# EAGLE board KickerBoard (EAGLE 7.4.0)
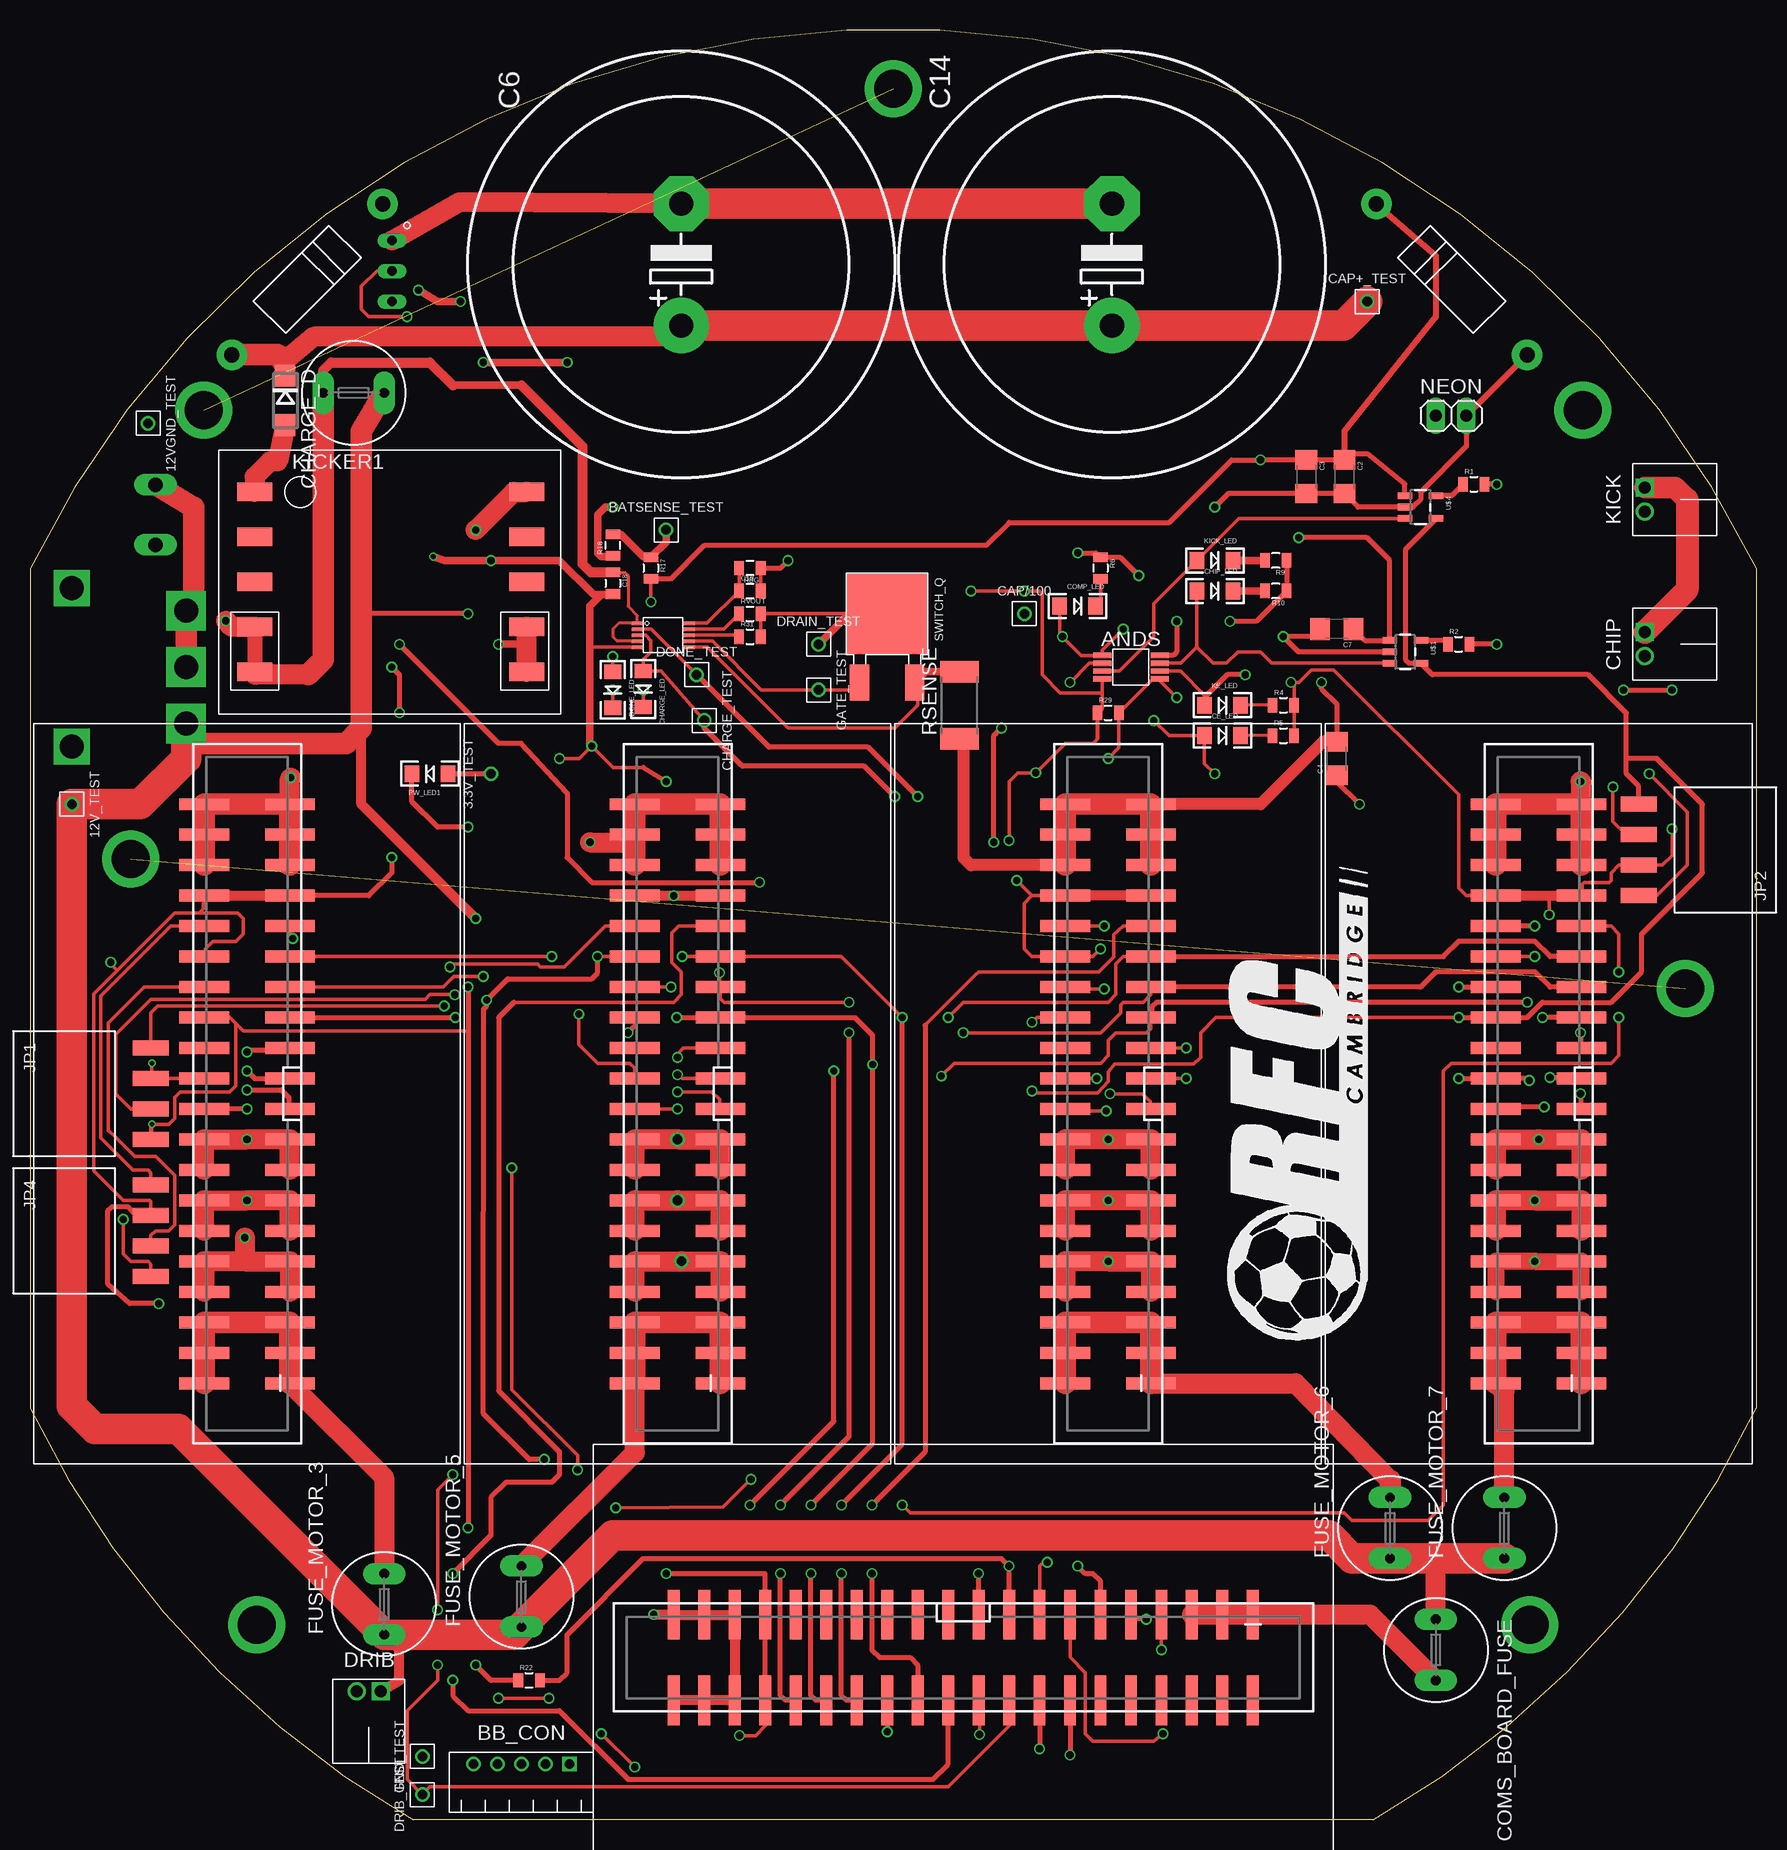
[diagram p3: board, top side]
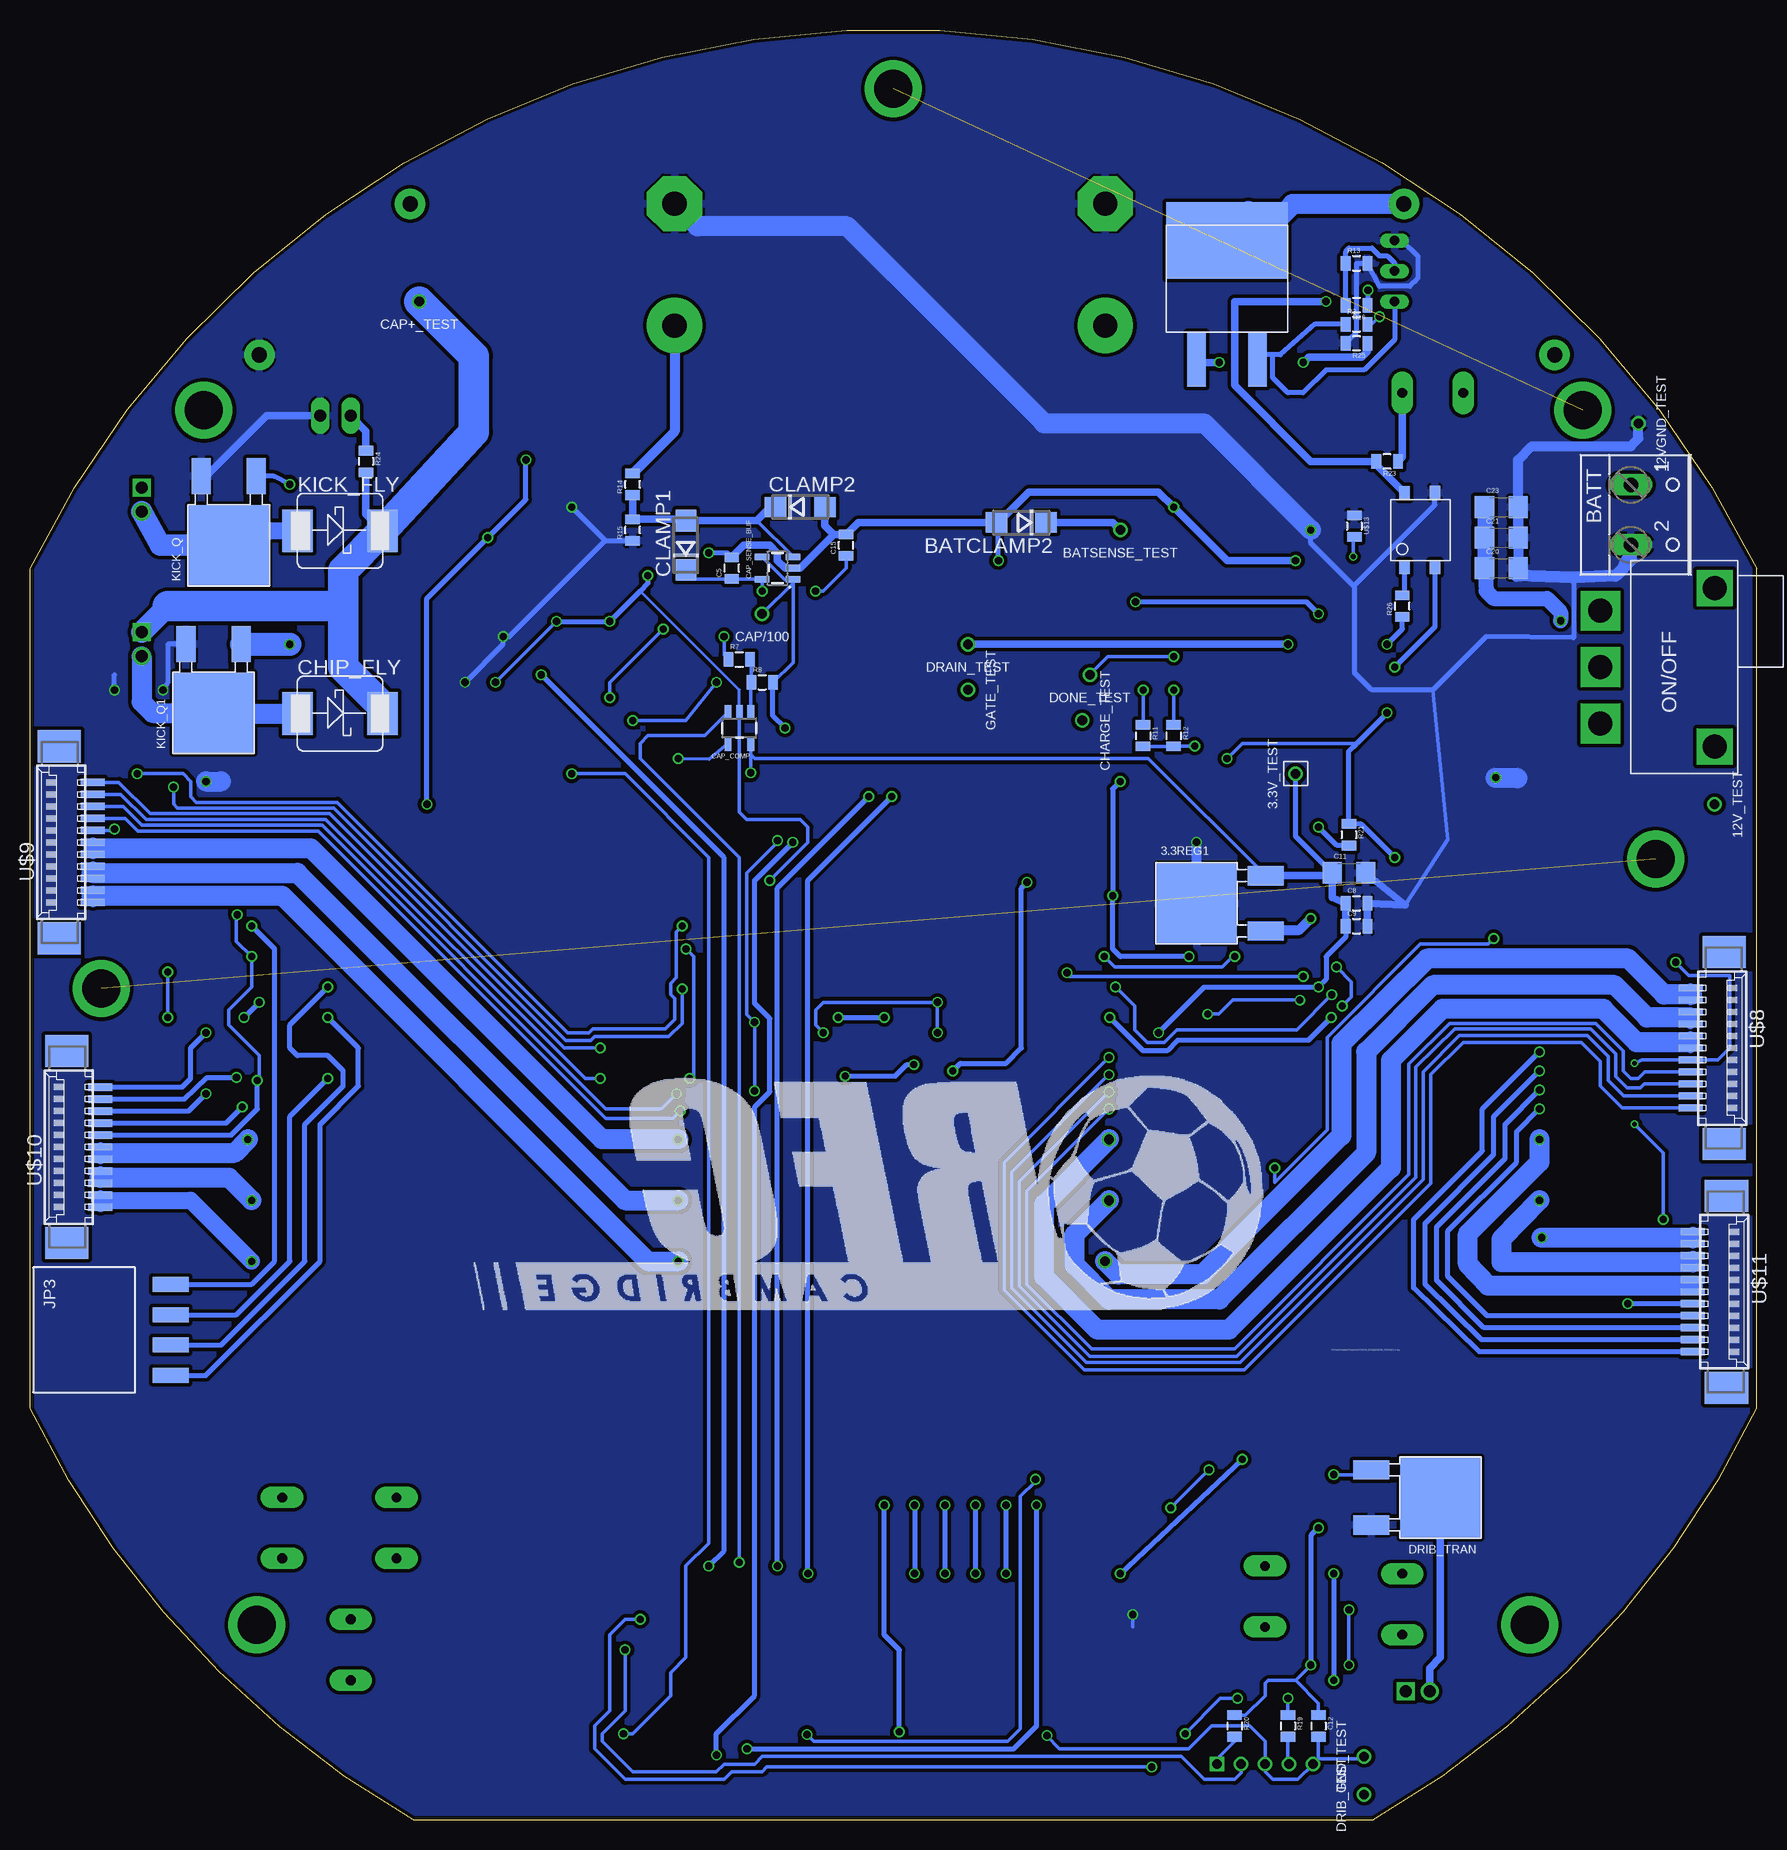
[diagram p4: board, bottom side, seen from below]

Size 143.88 x 149.19 mm. Coordinates in mm from the lower left corner, seen from the top.
Outline: 143.87,34.28 143.87,104.28 arc128 0,104.28 0,34.28 arc34 31.94,0 111.94,0 arc34 143.87,34.28
Copper layers (1*16): Top 0.018mm / dielectric 1.55mm / Bottom 0.018mm
Design rules "eC_2Layer_PClass6_BaseCopperO18_eCDefault": minimum track width 0.15mm, minimum drill 0.35mm, track to track 0.15mm, track to pad 0.15mm, pad to pad 0.15mm, via to via 0.15mm, smd to smd 0mil, copper to edge 0.25mm, drill to drill 0.35mm, minimum pad ring 0.175mm, minimum via ring 0.125mm, stop-mask expansion 0mil, vias tented up to drill 0.45mm, thermal gap 0.2mm

## Footprints (pad centres in the part's own frame; a part is rotated, then mirrored left to right if it is on the bottom)
DPAK = smd 6.7 x 6.7: DRAIN 0,0 | smd 3 x 1.6: GATE 5.75,-2.3; SOURCE 5.75,2.3
TESTING_PT = drill 0.8: P$1 0,0
TSSOP8 = smd 1.5 x 0.45: P$1 -2.4,0.975; P$2 -2.4,0.325; P$3 -2.4,-0.325; P$4 -2.4,-0.975; P$5 2.4,-0.975; P$6 2.4,-0.325; P$7 2.4,0.325; P$8 2.4,0.975
DO214AC = smd 1.8 x 1.7: A 2.05,0; C -2.05,0
W237-102 = drill 1.194 long: 1 -2.5,-1.27; 2 2.5,-1.27
JST-5-2MM = drill 0.8 square: 1 4,0 | drill 0.8: 2 2,0; 3 0,0; 4 -2,0; 5 -4,0
1206 = smd 1.6 x 1.8: 1 -1.4,0; 2 1.4,0
0805 = smd 0.8 x 1.2: 1 -0.9,0; 2 0.9,0
EB35D = drill 2.007 pad 4.597: + -5.08,0 | drill 2.007 pad 4.597 octagon: - 5.08,0
SOT23-5 = smd 0.55 x 1.2: 1 -0.95,-1.3; 2 0,-1.3; 3 0.95,-1.3; 4 0.95,1.3; 5 -0.95,1.3
LED-1206 = smd 1.2 x 1.4: A -1.5,0; C 1.5,0
10-MSOP = smd 0.97 x 0.31: P$1 -0.485,-0.155; P$2 -0.485,-0.655; P$3 -0.485,-1.155; P$4 -0.485,-1.655; P$5 -0.485,-2.155; P$6 3.785,-2.155; P$7 3.785,-1.655; P$8 3.785,-1.155; P$9 3.785,-0.655; P$10 3.785,-0.155
JST-2-2MM = drill 1 square: 1 1,1 | drill 1: 2 -1,1
DO214AB = smd 2.54 x 3.556: ANODE 0,3.111; CATHODE 7.112,3.111
2X20_SHROUDED_SMT = smd 4.14 x 0.991: 1 -3.569,24.13; 2 3.569,24.13; 3 -3.569,21.59; 4 3.569,21.59; 5 -3.569,19.05; 6 3.569,19.05; 7 -3.569,16.51; 8 3.569,16.51; 9 -3.569,13.97; 10 3.569,13.97; 11 -3.569,11.43; 12 3.569,11.43; 13 -3.569,8.89; 14 3.569,8.89; 15 -3.569,6.35; 16 3.569,6.35; 17 -3.569,3.81; 18 3.569,3.81; 19 -3.569,1.27; 20 3.569,1.27; 21 -3.569,-1.27; 22 3.569,-1.27; 23 -3.569,-3.81; 24 3.569,-3.81; 25 -3.569,-6.35; 26 3.569,-6.35; 27 -3.569,-8.89; 28 3.569,-8.89; 29 -3.569,-11.43; 30 3.569,-11.43; 31 -3.569,-13.97; 32 3.569,-13.97; 33 -3.569,-16.51; 34 3.569,-16.51; 35 -3.569,-19.05; 36 3.569,-19.05; 37 -3.569,-21.59; 38 3.569,-21.59; 39 -3.569,-24.13; 40 3.569,-24.13
TR5 = drill 0.813 pad 1.778 long: 1 -2.54,0; 2 2.54,0
1X04_SMD_RA_FEMALE = smd 1.25 x 3: 1 -3.81,7.225; 2 -1.27,7.225; 3 1.27,7.225; 4 3.81,7.225
1X02 = drill 1.016 long: 1 -1.27,0; 2 1.27,0
CK_SWITCH = drill 2 pad 3.302 square: COM 0,0; IN1 4.699,0; IN2 -4.699,0 | drill 2 pad 2.54 square: SUP1 -6.604,-9.525; SUP2 6.604,-9.525
R2512 = smd 1.8 x 3.2: 1 -2.8,0; 2 2.8,0
TO-263 = smd 1.524 x 4.572: LOWER_LEFT 2.54,-2.286; LOWER_RIGHT 7.62,-2.286 | smd 10.16 x 6.35: TAB 5.08,7.62
10-TRANSFORMER = smd 2.92 x 1.52: P$1 0,0; P$2 0,-3.75; P$3 0,-7.5; P$4 0,-11.25; P$5 0,-15; P$6 22.67,-15; P$7 22.67,-11.25; P$8 22.67,-7.5; P$9 22.67,-3.75; P$10 22.67,0
SOP4 = smd 0.889 x 1.143: 1 0.813,-0.584; 2 3.353,-0.584; 3 3.353,5.664; 4 0.813,5.639
TO92 = drill 0.8 long: CENTER 2.54,0; LEFT 0,0; RIGHT 5.08,0
THROUGH-HOLE-2 = drill 1.27 pad 2.54: + 0,0; - 17.78,0
GEN3CON = smd 0.61 x 2: 1 5,-2; 2 4,-2; 3 3,-2; 4 2,-2; 5 1,-2; 7 -1,-2; 8 -2,-2; 9 -3,-2; 10 -4,-2; 11 -5,-2 | smd 0.6 x 2: 6 0,-2 | smd 2.68 x 3.6: S1 8,0.8; S2 -8,0.8

## Placement (x,y rotation side)
3.3REG1  3.3REG1AREG  [DPAK]  46.66,76.39 0 bottom
3.3V_TEST  TEST_PT  [TESTING_PT]  38.41,87.19 90 bottom
12V_TEST  TEST_PT  [TESTING_PT]  3.48,84.65 270 top
12VGND_TEST  TEST_PT  [TESTING_PT]  9.83,116.4 270 top
ANDS  AND-DUAL  [TSSOP8]  91.75,96.08 180 top
BATCLAMP2  DIODE-ZENERDO214AC  [DO214AC]  61.27,108.14 180 bottom
BATSENSE_TEST  TEST_PT  [TESTING_PT]  53.01,107.51 0 top
BATT  [W237-102]  9.2,108.78 270 bottom
BB_CON  JST-5  [JST-5-2MM]  40.95,4.64 0 top
C2  .1uF  [1206]  109.53,111.95 270 top
C3  10uF  [1206]  106.35,111.95 270 top
C4  .1uF  [1206]  108.89,88.46 90 top
C5  .1uF  [0805]  85.4,104.33 90 bottom
C6  1500uF  [EB35D]  54.26,129.64 90 top
C7  10uF  [1206]  108.89,99.25 180 top
C8  1uF  [0805]  33.33,76.39 0 bottom
C9  .01uF  [0805]  33.33,74.49 0 bottom
C11  47uF  [1206]  33.96,78.93 0 bottom
C12  4.7uF  [0805]  36.5,7.81 270 bottom
C14  1500uF  [EB35D]  90.16,129.64 90 top
C15  .1uF  [0805]  75.87,106.24 90 bottom
C18  10uF  [0805]  48.57,103.06 270 top
C19  100pF  [0805]  60,102.43 0 top
C20  47uF  [1206]  21.26,104.33 0 bottom
C21  47uF  [1206]  21.26,106.87 0 bottom
C23  47uF  [1206]  21.26,109.41 0 bottom
CAP+_TEST  TEST_PT  [TESTING_PT]  111.43,126.56 0 top
CAP/100  TEST_PT  [TESTING_PT]  82.86,100.52 0 top
CAP_COMP  LM331  [SOT23-5]  84.76,91 180 bottom
CAP_SENSE_BUF  MCP6291T-E/OT  [SOT23-5]  81.59,104.33 90 bottom
CE_LED  [LED-1206]  99.37,90.36 0 top
CHARGE_D  1kV, ultrafast  [DO214AC]  21.26,118.3 270 top
CHARGE_LED  [LED-1206]  51.11,94.25 270 top
CHARGE_TEST  TEST_PT  [TESTING_PT]  56.19,91.63 270 top
CHARGE_U  LT3750  [10-MSOP]  51.11,99.89 0 top
CHIP  JST-22MM  [JST-2-2MM]  135.56,97.98 90 top
CHIP_FLY  DIODE-ZENERDO214AB  [DO214AB]  121.59,89.09 0 bottom
CHIP_LED  [LED-1206]  98.73,102.43 0 top
CLAMP1  DIODE-ZENERDO214AC  [DO214AC]  89.21,106.24 90 bottom
CLAMP2  DIODE-ZENERDO214AC  [DO214AC]  79.68,109.41 0 bottom
COM_BOARD  M20X2SHROUDED_SMT  [2X20_SHROUDED_SMT]  77.78,13.53 270 top
COMP_LED  [LED-1206]  87.3,101.16 0 top
COMS_BOARD_FUSE  [TR5]  117.15,14.16 270 top
DONE_LED  [LED-1206]  48.57,94.17 270 top
DONE_TEST  TEST_PT  [TESTING_PT]  55.55,95.44 0 top
DRAIN_TEST  TEST_PT  [TESTING_PT]  65.71,97.98 0 top
DRIB  JST-22MM  [JST-2-2MM]  28.25,9.72 0 top
DRIB_TEST  TEST_PT  [TESTING_PT]  32.69,2.1 90 top
DRIB_TRAN  [DPAK]  26.34,26.86 180 bottom
FRAME4  FRAME-LETTER  [CREATIVE_COMMONS]  36.5,-39.18 0 top  (outside the outline)
FUSE_MOTOR_3  [TR5]  29.52,17.97 90 top
FUSE_MOTOR_5  [TR5]  40.95,18.61 90 top
FUSE_MOTOR_6  [TR5]  113.34,24.32 90 top
FUSE_MOTOR_7  [TR5]  122.86,24.32 90 top
GATE_TEST  TEST_PT  [TESTING_PT]  65.71,94.17 270 top
GND_TEST  TEST_PT  [TESTING_PT]  32.69,5.27 90 top
JP1  [1X04_SMD_RA_FEMALE]  2.85,60.52 270 top
JP2  [1X04_SMD_RA_FEMALE]  141.28,80.84 90 top
JP3  [1X04_SMD_RA_FEMALE]  139.37,40.83 270 bottom
JP4  [1X04_SMD_RA_FEMALE]  2.85,49.09 270 top
KE_LED  [LED-1206]  99.37,92.9 0 top
KICK  JST-22MM  [JST-2-2MM]  135.56,110.05 90 top
KICK_FLY  DIODE-ZENERDO214AB  [DO214AB]  121.59,104.33 0 bottom
KICK_LED  [LED-1206]  98.73,104.97 0 top
KICK_Q  [DPAK]  127.31,106.24 90 bottom
KICK_Q1  [DPAK]  128.58,92.27 90 bottom
KICKER1  [TR5]  26.98,118.94 180 top
MOTOR1  M20X2SHROUDED_SMT  [2X20_SHROUDED_SMT]  18.09,60.52 180 top
MOTOR2  M20X2SHROUDED_SMT  [2X20_SHROUDED_SMT]  53.97,60.52 180 top
MOTOR3  M20X2SHROUDED_SMT  [2X20_SHROUDED_SMT]  89.84,60.52 180 top
MOTOR4  M20X2SHROUDED_SMT  [2X20_SHROUDED_SMT]  125.72,60.52 180 top
NEON  [1X02]  118.42,117.03 0 top
ON/OFF  SPDT-SWITCH  [CK_SWITCH]  13.01,96.08 90 bottom
PW_LED1  [LED-1206]  33.33,87.19 180 top
R1  100  [0805]  120.32,111.32 0 top
R2  100  [0805]  119.05,97.98 0 top
R3  250k  [0805]  33.33,124.65 0 bottom
R4  1k  [0805]  104.45,92.9 0 top
R5  1k  [0805]  104.45,90.36 0 top
R6  1k  [0805]  89.21,104.33 270 top
R7  100k  [0805]  84.76,96.71 0 bottom
R8  3k  [0805]  82.86,94.81 0 bottom
R9  1k  [0805]  103.81,104.97 180 top
R10  1k  [0805]  103.81,102.43 180 top
R11  1k  [0805]  51.11,90.36 270 bottom
R12  1k  [0805]  48.57,90.36 270 bottom
R13  2.5k  [0805]  33.33,129.73 0 bottom
R14  1M  [0805]  93.65,111.32 90 bottom
R15  10K  [0805]  93.65,107.51 90 bottom
R16  1k  [0805]  33.33,126.24 180 bottom
R17  80k  [0805]  51.74,104.33 270 top
R18  20k  [0805]  48.57,106.24 90 top
R19  20  [0805]  39.04,7.81 270 bottom
R20  100  [0805]  43.49,7.81 270 bottom
R21  1k  [0805]  33.96,82.11 270 bottom
R22  1k  [0805]  41.58,11.62 0 top
R23  1.5k  [0805]  30.79,113.22 180 bottom
R24  536k  [0805]  115.88,113.22 270 bottom
R25  200  [0805]  33.33,123.07 180 bottom
R26  300  [0805]  29.52,101.16 90 bottom
R29  10k  [0805]  89.84,92.27 0 top
R31  43k  [0805]  60,98.62 0 top
RBG  2.49k  [0805]  60,104.33 180 top
RSENSE  10m  [R2512]  77.46,92.9 90 top
RVOUT  50.4k  [0805]  60,100.52 0 top
SWITCH_Q  [DPAK]  71.43,100.52 270 top
U$1  FAN31111  [SOT23-5]  114.61,97.35 270 top
U$2  IXTA3N50D2  [TO-263]  49.2,124.02 0 bottom
U$3  32052-TRANSFORMER  [10-TRANSFORMER]  18.72,110.68 0 top
U$4  FAN31111  [SOT23-5]  115.88,109.41 270 top
U$5  VO1400AEFTR  [SOP4]  30.15,104.97 0 bottom
U$6  ZTX718  [TO92]  30.15,131.64 270 top
U$7  1N4007  [THROUGH-HOLE-2]  16.82,122.11 45 top
U$8  MOTORCON  [GEN3CON]  3.48,64.33 270 bottom
U$9  MOTORCON  [GEN3CON]  140.64,81.47 90 bottom
U$10  MOTORCON  [GEN3CON]  140.01,56.07 90 bottom
U$11  MOTORCON  [GEN3CON]  3.29,44.01 270 bottom
U$12  13VZENER  [THROUGH-HOLE-2]  124.77,122.11 135 top
U$13  INDUCTOR  [0805]  33.51,107.84 270 bottom

## Tracks (layer width: path | path; a pad name or v marks a point on that pad's centre or on a via)
3.3V  (via drill 0.38, 0.6)
  Top 0.305: 89.35,93.94 89.35,92.67 R29.1 88.94,90.1 | 89.35,93.94 ANDS.P$8 89.35,92.57 88.97,92.19 88.97,90.13 88.94,90.1 | JP4.4 10.07,46.31 9.83,46.55 8.4,46.55 7.77,47.18 v7.77,50.04 | v10.15,57.98 10.15,56.79 JP1.4 10.07,57.9 v10.15,57.98 | v10.15,57.98 11.58,57.98 12.06,58.46 12.06,60.2 12.53,60.68 16.66,60.68 17.14,61.15 17.14,66.39 | 17.14,66.39 16.66,66.87 MOTOR1.26 | 17.14,66.39 17.77,65.76 36.34,65.76 36.5,65.6 | 88.94,90.1 88.57,89.73 86.27,89.73 v83.81,87.27 82.3,87.27 81.59,86.55 v81.59,81.63 | v78.41,102.43 v82.86,102.43 84.13,102.43 84.37,102.19 84.37,95.44 85.87,93.94 89.35,93.94 | v83.49,66.47 83.89,66.87 MOTOR3.26 | 114.61,96.71 114.93,96.4 115.96,96.4 115.96,96.32 116.83,95.44 129.85,95.44 | 124.77,66.87 98.81,66.87 97.54,65.6 97.54,63.54 96.99,62.98 90.4,62.98 89.84,62.35 89.84,61.55 88.97,60.6 83.65,60.6 v83.49,60.76
  Top 0.406: U$4.4 114.61,105.89 114.61,96.71 114.92,96.4 U$1.4 116.86,95.44 129.85,95.44 133.02,92.27 133.02,88.46 | v36.5,69.41 36.5,65.6 v36.5,24.32 | R22.1 38.41,11.62 v37.14,12.89 | PW_LED1.A 3.3V_TEST.P$1 | v49.84,65.6 50.47,66.23 50.47,66.79 MOTOR2.26 | v119.05,66.87 MOTOR4.26 124.77,66.87 126.04,68.14 131.75,68.14 134.29,70.68 134.29,73.85 139.37,78.93 139.37,84.65 135.56,88.46 133.02,88.46 | JP2.4 134.05,86.16 133.02,87.19 133.02,88.46
  Bottom 0.305: 3.3REG1.SOURCE 50.68,88.46 83.49,88.46 83.81,88.78 CAP_COMP.5 v83.81,87.27 | C5.1 82.94,103.43 CAP_SENSE_BUF.5 82.86,103.35 v82.86,102.43 82.86,103.38 82.91,103.43 C5.1 | C5.1 88.45,103.43 arc90 CLAMP1.C | v7.77,50.04 7.77,55.6 v10.15,57.98 | R20.1 42.59,8.71 40.95,10.35 40.95,11.36 R22.1 38.41,11.62 | 38.41,11.62 v37.14,12.89 | C15.1 75.87,104.33 77.78,102.43 v78.41,102.43 | v81.59,81.63 81.59,81.47 84.13,78.93 84.13,67.11 v83.49,66.47 v83.49,60.76 | C12.1 36.5,9.72 38.41,11.62
  Bottom 0.406: C9.1 34.23,73.59 35.87,71.95 35.87,70.04 v36.5,69.41 46.03,69.41 v49.84,65.6 | v37.14,12.89 37.14,23.69 v36.5,24.32 | C11.1 38.41,81.98 3.3V_TEST.P$1 | JP3.4 129.21,37.02 119.69,46.55 119.69,57.98 116.51,61.15 116.51,64.33 v119.05,66.87
  Bottom 0.61: C9.1 C8.1 35.36,76.89 C11.1 35.6,78.69 3.3REG1.SOURCE
12V  (via drill 0.6)
  Top 0.305: v51.74,101.53 R17.2
  Top 0.406: U$4.1 114.58,111.35 111.43,113.86 109.53,113.86 C2.1 C3.1 v102.54,113.35 100.13,113.35 94.92,108.14 81.59,108.14 79.68,106.24 56.19,106.24 53.38,103.43 R17.2 | v105.72,106.87 111.43,106.87 113.31,105 U$1.1 111.25,98.3 C7.1 | C4.1 108.89,86.55 v110.8,84.65 | v36.5,100.52 27.61,100.52
  Top 0.508: U$12.- 117.15,130.37 117.15,125.29 109.53,115.76 C2.1
  Top 0.61: ON/OFF.IN2 13.26,89.73
  Top 0.813: DRIB.1 30.79,11.62 30.79,14.16 FUSE_MOTOR_3.1 | v37.14,75.12 27.61,84.65 27.61,91
  Top 1.676: COMS_BOARD_FUSE.1 117.15,21.15 117.78,21.78 118.42,21.78
  Top 1.778: 13.26,89.73 26.34,89.73 27.61,91 27.61,100.52 27.61,115.76 KICKER1.1
  Top 2.54: ON/OFF.IN2 13.01,88.46 9.2,84.65 12V_TEST.P$1 3.48,34.48 5.39,32.58 12.37,32.58 FUSE_MOTOR_3.1 40.31,15.43 FUSE_MOTOR_5.1 48.57,23.69 108.26,23.69 110.16,21.78 FUSE_MOTOR_6.1 118.42,21.78 FUSE_MOTOR_7.1
  Bottom 0.406: v102.54,113.35 102.54,110.05 v105.72,106.87 110.8,101.79 v110.8,84.65 | v51.74,101.53 37.51,101.53 v36.5,100.52
  Bottom 0.61: R23.1 29.52,113.59 KICKER1.1
  Bottom 0.813: 3.3REG1.GATE 40.36,74.17 38.09,74.17 v37.14,75.12
12V-KICKER  (via drill 0.6)
  Top 0.254: CHARGE_U.P$4 48.95,98.23 48.57,98.62 48.57,99.25 49.05,99.73 CHARGE_U.P$1 50.62,100.37 49.84,101.16 49.84,103.7 49.57,103.96 C18.1
  Top 0.61: 35.23,119.57 40.95,119.57
  Top 0.813: 24.44,96.71 24.44,120.84 25.07,121.48 33.33,121.48 35.23,119.57 | 40.95,119.57 46.03,114.49 46.03,104.7 46.77,103.96 C18.1
  Top 1.27: U$3.P$4 U$3.P$5
  Top 1.676: 23.17,95.44 18.8,95.44 U$3.P$5 | U$3.P$4 16.82,99.43 v16.31,99.94
  Top 1.778: KICKER1.2 24.44,96.71 23.17,95.44
  Bottom 1.27: C23.1 C21.1 C20.1 22.53,102.43 21.9,101.79 17.45,101.79 16.31,100.65 v16.31,99.94
12VGND  (via drill 0.6)
  Top 0.305: COM_BOARD.39
  Top 0.406: NEON.2 119.69,114.49 115.88,110.68 115.88,110.05 115.24,109.41 U$4.2 110.67,109.41 C2.2 C3.2 99.87,110.55 v98.73,109.41 | U$1.2 105.72,97.35 v104.45,98.62 106.86,98.62 C7.2 | v107.62,94.81 107.62,94.3 108.89,93.03 C4.2 | v132.79,94.17 v136.83,94.17
  Top 0.508: NEON.2 U$12.+
  Top 0.813: COM_BOARD.39 COM_BOARD.37 COM_BOARD.35 COM_BOARD.36 COM_BOARD.38 COM_BOARD.40 | COM_BOARD.39 v51.98,17.1
  Top 1.016: C4.2 107.75,89.86 102.54,84.65 MOTOR3.39 | MOTOR3.40 86.27,80.44 86.03,79.57 78.41,79.57 77.78,80.2 77.78,89.79 RSENSE.1
  Top 1.676: v37.14,107.51 40.31,110.68 U$3.P$10 | C6.- 35.75,134.81 U$6.LEFT | v46.66,81.47 50.4,81.47 | MOTOR1.39 21.66,86.79 v21.74,86.87 | MOTOR4.39 129.29,86.48 v129.21,86.55
  Top 1.778: MOTOR4.36 MOTOR4.38 MOTOR4.40 MOTOR4.39 MOTOR4.37 MOTOR4.35 | MOTOR1.36 MOTOR1.38 MOTOR1.40 MOTOR1.39 MOTOR1.37 MOTOR1.35 | MOTOR2.36 50.4,81.47 MOTOR2.38 MOTOR2.40 MOTOR2.39 MOTOR2.37 MOTOR2.35 | MOTOR3.36 MOTOR3.38 MOTOR3.40 MOTOR3.39 MOTOR3.37 MOTOR3.35
  Top 2.54: C6.- C14.-
  Bottom 0.305: 29.25,76.26 25.71,81.71 26.98,94.17 | v51.98,17.1 51.98,16.07
  Bottom 0.406: 33.52,102.78 37.14,106.4 v37.14,107.51 | v98.73,109.41 95.93,106.61 | 95.93,106.61 R15.1 | 95.93,106.61 103.92,98.62 v104.45,98.62 104.45,97.98 v107.62,94.81 | 33.52,102.78 33.52,95.63 32.06,94.17 26.98,94.17 22.53,98.62 15.23,98.54 15.23,103.54 11.7,103.74 BATT.2 | 33.52,102.78 33.52,102.87 26.8,109.59 U$5.3 | R25.2 33.96,123.38 33.33,124.02 33.33,129.73 R13.2 32.38,129.68 31.42,127.83 28.88,127.83 28.25,128.46 28.25,130.37 29.52,131.64 U$6.LEFT | KICK_Q1.SOURCE 132.35,98.02 132.39,97.98 132.39,94.81 v132.79,94.17 | v136.83,94.17 136.83,95.44
  Bottom 0.61: C9.2 C8.2 29.25,76.26 C11.2 | NEON.2 124.13,117.03 129.18,111.99 KICK_Q.SOURCE
  Bottom 0.813: C23.2 C21.2 | C21.2 C20.2 | C21.2 19.86,113.35 18.72,114.49 10.47,114.49 9.83,115.13 12VGND_TEST.P$1 | 3.3REG1.DRAIN v46.66,81.47
  Bottom 1.016: BATT.2 10.47,105.01 11.74,103.7 15.23,103.54 19.99,103.7 C20.2
  Bottom 1.676: v37.14,107.51 46.03,116.4 59.36,116.4 75.78,132.81 88.26,132.81 C14.- | v21.74,86.87 19.99,86.87 19.91,86.79 | v129.21,86.55 127.94,86.55
  pour Bottom (isolate 0.305): -2.23,149.42 146.99,150.69 145.72,0.19 -0.33,-0.44
AND_CHIP
  Top 0.305: CHIP_LED.A 97.23,97.75 | 97.23,97.75 95.88,96.4 ANDS.P$3 | 97.23,97.75 98.59,96.4 99.69,96.4 100.64,97.35 102.54,97.35 103.49,96.4 U$1.3
AND_KICK
  Top 0.305: ANDS.P$7 90.79,95.75 93.65,98.62 93.65,101.39 KICK_LED.A 100.73,108.46 U$4.3
BAT+
  Top 1.778: BATT.1 13.64,109.37 | 13.64,109.37 13.64,109.41 | 13.64,109.37 13.64,100.14 ON/OFF.IN1 ON/OFF.COM
BATSENSE
  Top 0.305: 51.69,105.29 R17.1
  Top 0.61: R17.1 53.01,106.5 BATSENSE_TEST.P$1 | R18.2 49.26,107.14 51.11,105.29 51.69,105.29
  Bottom 0.61: BATSENSE_TEST.P$1 53.65,108.14 BATCLAMP2.C
BB_IN  (via drill 0.6)
  Top 0.305: v94.29,14.16 COM_BOARD.7
  Bottom 0.305: BB_CON.2 42.95,3.91 43.49,3.37 46.03,3.37 47.93,5.27 82.86,5.27 83.49,4.64 86.03,4.64 86.67,4 93.65,4 96.19,6.54 96.19,7.18 94.29,9.08 v94.29,14.16
BB_OUT  (via drill 0.6)
  Top 0.305: v39.04,10.12 v43.25,10.12 | v47.62,7.18 v50.39,4.4 | v93.02,16.7 92.14,16.7 COM_BOARD.9
  Bottom 0.305: R19.1 v39.04,10.12 | v43.25,10.12 44.68,10.12 v47.62,7.18 | v50.39,4.4 82.46,4.4 82.86,4 85.4,4 86.03,3.37 94.29,3.37 96.83,5.91 96.83,7.81 95.56,9.08 95.56,15.43 94.29,16.7 v93.02,16.7
CAP+
  Top 0.406: 53.73,124.02 C6.+
  Top 1.676: C6.+ 54.19,124.56 | 53.65,124.02 53.73,124.02 53.32,123.61 23.64,123.61 21.26,121.62 | CHARGE_D.C 21.26,121.62 | 21.12,121.48 21.26,121.62
  Top 1.778: KICK.1 137.1,111.05 138.1,110.05 | U$7.+ 20.63,122.11 21.12,121.48
  Top 1.93: 138.1,110.05 138.1,102.52 CHIP.1
  Top 2.54: C6.+ C14.+ 109.43,124.56 CAP+_TEST.P$1
  Bottom 0.61: KICK_FLY.CATHODE 115.88,108.84 R24.2
  Bottom 0.813: C14.+ 90.16,115.71 R14.2
  Bottom 1.676: 114.48,92.78 CHIP_FLY.CATHODE
  Bottom 1.778: CHIP.1 132.39,101.16
  Bottom 2.54: 117.78,101.16 117.78,104.14 KICK_FLY.CATHODE 106.89,115.67 106.89,122.02 CAP+_TEST.P$1 | 117.78,101.16 117.78,96.08 114.48,92.78 | 132.39,101.16 117.78,101.16
CHARGE  (via drill 0.6)
  Top 0.254: CHARGE_LED.A 51.11,95.44
  Top 0.305: CHARGE_LED.A 52.61,95.76 CHARGE_TEST.P$1 | 51.11,95.44 51.11,96.71 51.74,97.35 51.74,98.3 51.31,98.73 CHARGE_U.P$3
  Top 0.406: COM_BOARD.19 v79.05,20.51 | v72.06,85.28 69.52,87.82 59.36,87.82 56.19,91 CHARGE_TEST.P$1
  Bottom 0.406: v79.05,20.51 79.05,78.3 v72.06,85.28
CHARGE_DONE  (via drill 0.6)
  Top 0.305: CHARGE_U.P$2 51.76,99.23 DONE_TEST.P$1 | DONE_LED.A v48.57,96.95
  Top 0.406: COM_BOARD.17 v81.59,21.15 80.95,21.78 51.11,21.78 44.76,15.43 44.76,12.26 44.12,11.62 R22.2 | v73.97,85.28 69.84,89.41 61.59,89.41 DONE_TEST.P$1
  Bottom 0.305: v48.57,96.95 54.05,96.95 DONE_TEST.P$1
  Bottom 0.406: v81.59,21.15 81.59,77.66 v73.97,85.28
CHIP_ENABLE  (via drill 0.6)
  Top 0.305: ANDS.P$6 88.26,96.4 v86.67,94.81 | v93.65,91.63 94.92,90.36 CE_LED.A 97.87,88.05 v98.73,87.19 | COM_BOARD.13 86.67,13.53 87.94,12.26 87.94,7.18 88.57,6.54 93.65,6.54 v94.42,7.18
  Bottom 0.305: v86.67,94.81 89.21,91.63 v93.65,91.63 | v94.42,7.18 93.65,7.18 90.48,10.35 90.48,12.26 89.21,13.53 89.21,21.15 87.3,23.05 87.3,80.2 94.29,87.19 v98.73,87.19
COMP_OUT  (via drill 0.6)
  Top 0.305: v89.84,88.46 90.74,89.36 R29.2 93.58,95.1 ANDS.P$1 94.15,94.95 v95.56,93.54 | COMP_LED.A 85.8,98.85 v86.03,98.62 87.6,97.05 ANDS.P$5 89.35,97.49 v91.11,99.25
  Bottom 0.305: CAP_COMP.4 87.27,88.43 v89.84,88.46 | v86.03,98.62 86.03,97.08 R7.1 | v91.11,99.25 95.56,94.81 v95.56,93.54
DISCHARGE  (via drill 0.6)
  Top 0.406: COM_BOARD.16 v84.13,5.91 | v60,26.23 66.98,33.21 v66.98,62.42 | v30.79,97.98 39.04,89.73 40.95,89.73 44.76,85.6 44.76,80.2 46.82,78.14 v60.79,78.14
  Bottom 0.406: v84.13,5.91 61.9,5.91 60,7.81 v60,26.23 | v66.98,62.42 66.35,63.06 62.54,63.06 61.27,64.33 61.27,77.66 v60.79,78.14 | v30.79,97.98 29.52,99.25 R26.1
DIVCAP  (via drill 0.6)
  Top 0.406: COM_BOARD.14 v86.67,5.4 | v80.32,81.47 80.32,90.36 v80.95,91
  Bottom 0.305: CAP_SENSE_BUF.4 80.99,103.38 CAP_SENSE_BUF.1 | R8.2 80.29,96.48 CAP_SENSE_BUF.1 | CAP/100.P$1 80.29,103.09 CAP_SENSE_BUF.1
  Bottom 0.406: v86.67,5.4 86.67,7.18 83.49,10.35 83.49,59.41 82.22,60.68 82.22,66.79 83.49,68.06 83.49,78.3 v80.32,81.47 | v80.95,91 81.96,92 R8.2
DRIB  (via drill 0.6)
  Top 0.305: COM_BOARD.18 81.59,7.81 76.51,2.73 33.33,2.73 DRIB_TEST.P$1 31.42,3.37 31.42,9.08 33.96,11.62 v33.96,12.89 | v33.96,17.5 33.96,27.5 v35.23,28.77
  Bottom 0.305: v33.96,12.89 v33.96,17.5 | v35.23,28.77 32.49,28.77 DRIB_TRAN.GATE
GND  (via drill 0.38, 0.41, 0.58, 0.6)
  Top 0: C19.2 60.95,102.48 60.95,104.33
  Top 0.178: 34.6,104.97 34.57,104.97
  Top 0.305: RBG.1 C19.2 | 47.56,102.06 48.2,102.06 48.57,102.43 C18.2 48.57,102.11 | 46.66,99.25 46.67,97.98 | 46.67,97.98 46.68,97.73 CHARGE_U.P$5 | v10.15,63.06 10.15,61.87 JP1.2 MOTOR1.22 | JP4.2 10.07,51.55 9.99,51.63 7.77,51.63 5.31,54.09 5.31,68.85 7.25,70.8 | 7.25,70.8 12.06,75.6 14.12,75.6 | 14.12,75.6 14.44,75.92 14.44,76.95 MOTOR1.34 | 14.12,75.6 17.29,75.6 17.77,75.12 17.77,73.85 17.14,73.22 15.23,73.22 14.6,72.58 14.6,72.03 MOTOR1.30 | v136.83,82.59 136.83,80.36 136.04,79.57 JP2.2 132.39,79.57 131.75,78.93 131.75,78.3 131.59,78.14 129.53,78.14 129.37,77.98 129.37,77.11 MOTOR4.33 | v59.13,7.02 60.47,7.02 61.27,7.81 COM_BOARD.34 | v6.74,71.47 6.74,71.31 7.25,70.8 | v45.75,67.15 45.75,64.61 47.3,63.06 50,63.06 50.39,62.66 MOTOR2.22 | 46.66,97.97 46.67,97.98 | v44.12,88.46 45.79,88.46 v46.82,89.49 | v33.61,105.3 33.63,105.3 34.6,104.97 | 47.46,102.11 47.46,101.95 | 46.66,89.65 v46.82,89.49 | 51.11,87.72 48.6,87.72 v46.82,89.49 | MOTOR3.34 83.49,77.03 | 83.49,77.03 82.86,76.39 82.86,72.58 83.49,71.95 MOTOR3.30 88.57,71.95 v89.21,72.58 | 83.49,77.03 v82.22,78.3 | R5.2 R4.2 105.35,94.54 v105.08,94.81 105.72,94.81 106.75,95.84 108.66,95.84 119.05,85.44 119.05,77.66 119.69,77.03 MOTOR4.34 | v126.59,75.44 126.59,76.63 126.2,77.03 | MOTOR4.30 v125.4,71.95 | v88.89,61.79 MOTOR3.22 | MOTOR2.30 v47.3,71.95
  Top 0.406: RBG.1 60.95,104.33 62.54,104.33 v63.17,104.97 | v87.3,105.6 88.84,105.6 R6.1 90.85,105.23 v92.38,103.7 | v95.56,99.89 95.56,97.35 95.26,97.05 ANDS.P$4 | R9.1 R10.1 102.17,99.89 v100,99.89 | COM_BOARD.34 COM_BOARD.33 61.27,20.51 v53.01,20.51 | 51.11,87.72 v53.01,86.55 | R18.1 48.52,105.29 | v42.85,30.04 41.58,30.04 37.77,33.85 37.8,67.58 38.05,67.83 v38.05,68.32 39.83,70.1 46.81,70.1 47.3,70.6 v47.3,71.95 | v30.15,96.08 30.79,95.44 v30.79,92.27 | v10.72,43.03 8.28,43.03 6.5,44.64 6.5,50.77 6.85,51.12 8.12,51.12 8.82,50.36 JP4.2 | v124.93,61.63 124.77,61.79 MOTOR4.22 v119.05,61.79 | v30.15,80.2 30.15,78.93 28.25,77.03 MOTOR1.33
  Top 0.61: 47.56,102.06 47.46,101.95 46.66,101.16 46.66,99.25 46.66,89.65 | 48.52,105.29 47.62,105.29 47.3,105.6 47.3,108.78 47.93,109.41 v48.57,109.41 | 48.57,102.11 47.46,102.11 46.98,102.11 44.12,104.97 v38.41,104.97 34.6,104.97 | 34.57,104.97 v33.61,105.3
  Top 0.813: MOTOR1.34 MOTOR1.33 | MOTOR2.34 v53.65,77.03 MOTOR2.33 | MOTOR3.33 MOTOR3.34 | MOTOR4.34 126.2,77.03 MOTOR4.33
  Bottom 0.254: CAP_COMP.2 84.76,94.17 93.02,102.43
  Bottom 0.305: v105.08,94.81 v100,99.89 | 33.33,89.73 42.85,89.73 v44.12,88.46 | v45.75,67.15 44.81,67.15 43.64,68.32 v38.05,68.32 | v10.15,63.06 9.56,63.33 U$8.5 3.21,63.33 2.21,64.33 2.21,70.36 5.63,70.36 v6.74,71.47 | U$9.5 136.94,82.47 v136.83,82.59 | C12.2 36.5,5.08 | 36.5,5.08 BB_CON.5 38.22,3.37 40.31,3.37 40.95,4 BB_CON.3 40.95,6.54 42.22,7.81 45.39,7.81 47.3,5.91 58.09,5.91 v59.13,7.02 | 36.5,5.08 32.88,5.08 GND_TEST.P$1 | v46.82,89.49 48.54,89.49 R12.2 R11.2 | v82.22,78.3 79.05,81.47 79.05,82.74 79.68,83.38 84.13,83.38 84.76,84.01 CAP_COMP.2 | v126.59,75.44 126.67,75.36 126.67,73.22 v125.4,71.95 125.4,69.41 127.31,67.5 127.31,66.23 124.77,63.69 124.77,61.79 v124.93,61.63 | v89.21,72.58 88.57,71.95 88.57,61.79 v88.89,61.79 | v33.61,105.3 33.61,106.84 U$13.2
  Bottom 0.406: v63.17,104.97 63.17,108 BATCLAMP2.A 63.17,108.14 | C5.2 85.77,105.6 v87.3,105.6 | v92.38,103.7 92.38,103.06 93.02,102.43 v95.56,99.89 v100,99.89 | v53.01,86.55 53.65,85.92 v53.65,77.03 53.65,72.58 53.01,71.95 v47.3,71.95 | v53.01,20.51 v42.85,30.04 | U$5.2 26.8,99.43 v30.15,96.08 | v30.79,92.27 33.33,89.73 33.96,89.09 R21.1 33.94,82.98 32.93,82.98 v30.15,80.2 | U$11.5 10.74,43.01 v10.72,43.03 | U$10.5 127.1,57.07 124.93,59.25 v124.93,61.63 | JP3.2 126.67,42.1 122.23,46.55 122.23,58.61 v119.05,61.79
  Bottom 0.61: BATCLAMP2.A 74.87,108.14 C15.2 76.88,107.14 | 76.88,107.14 79.68,104.33 CAP_SENSE_BUF.2 80.95,104.33 81.59,104.97 81.59,105.6 82.22,106.24 84.39,106.24 C5.2 | 76.88,107.14 77.63,107.89 CLAMP2.A | v38.41,104.97 44.12,104.97 v48.57,109.41 49.84,110.68 60.63,110.68 63.17,108.14
HYSTERESIS
  Bottom 0.305: CAP_COMP.1 83.81,94.75 R8.1 83.76,96.61 R7.2
KICK_ENABLE  (via drill 0.6)
  Top 0.254: 97.46,92.9 KE_LED.A
  Top 0.305: ANDS.P$2 95.88,95.75 97.87,93.77 97.87,93.54 KE_LED.A
  Top 0.406: COM_BOARD.11 89.21,19.88 88.57,20.51 87.94,20.51 v87.3,21.15 | v101.27,95.44 99.77,95.44 97.87,93.54
  Bottom 0.406: v87.3,21.15 86.03,22.42 86.03,80.2 v101.27,95.44
KICK_REF  (via drill 0.6)
  Top 0.305: v84.76,21.47 84.45,21.47 84.13,21.15 COM_BOARD.15
  Bottom 0.305: CAP_COMP.3 87.65,90.36 92.38,90.36 93.02,89.73 93.02,88.46 84.76,80.2 v84.76,21.47
LOWCHIP
  Bottom 1.676: CHIP.2 134.56,93.17 133.66,92.27 KICK_Q1.DRAIN 128.52,92.21 CHIP_FLY.ANODE
LOWKICK
  Bottom 1.422: KICK_Q.DRAIN 127.88,107.45 KICK_FLY.ANODE
  Bottom 1.778: KICK.2 133.02,106.24 KICK_Q.DRAIN
M1QA-1
  Top 0.305: JP4.3 10.07,48.69 10.47,49.09 11.58,49.09 12.06,49.57 12.06,53.69 10.47,55.28 8.72,55.28 7.06,56.95 6.53,57.47 6.53,66.42 7.04,66.93 7.06,66.95 9.52,69.41 MOTOR1.28
M1QA-2  (via drill 0.6)
  Top 0.305: JP1.3 8.4,59.25 7.17,60.49 7.17,65.47 10.07,68.38 32.93,68.38 33.33,68.77 v35.39,68.77 | v53.41,69.41 MOTOR2.28
  Bottom 0.305: v35.39,68.77 38.33,65.84 48.33,65.84 49.36,64.81 50.79,64.81 51.82,65.84 51.82,67.82 v53.41,69.41
M1QA-3  (via drill 0.6)
  Top 0.305: JP2.3 133.02,82.11 131.91,83.22 v131.91,86.08 | v89.53,69.25 86.43,69.25 MOTOR3.28
  Bottom 0.305: v131.91,86.08 131.91,84.65 131.59,84.33 118.58,84.33 99.21,64.96 97.15,64.96 96.83,65.28 90.64,65.28 89.53,66.39 v89.53,69.25
M1QA-4  (via drill 0.6)
  Top 0.406: v119.05,69.41 MOTOR4.28
  Bottom 0.406: JP3.3 127.94,39.56 120.96,46.55 120.96,57.98 117.78,61.15 117.78,62.42 119.05,63.69 121.59,63.69 122.23,64.33 122.23,66.23 v119.05,69.41
M1QB-1
  Top 0.305: JP4.1 10.07,53.93 9.83,54.17 8.56,54.17 5.9,56.84 5.9,68.65 11.74,74.49 MOTOR1.32
M1QB-2  (via drill 0.6)
  Top 0.305: JP1.1 10.07,67.27 10.63,67.82 v34.52,67.82 | v35,71.08 35.23,71.31 42.3,71.31 42.54,71.08 44.52,71.08 47.93,74.49 MOTOR2.32
  Bottom 0.305: v34.52,67.82 33.77,68.57 33.77,69.85 v35,71.08
M1QB-3  (via drill 0.6)
  Top 0.305: JP2.1 135.56,77.03 138.1,79.57 138.1,84.01 v134.93,87.19 | v89.53,74.49 MOTOR3.32
  Bottom 0.305: v134.93,87.19 131.12,87.19 130.48,86.55 130.48,85.28 130.01,84.81 118.26,84.81 99.05,65.6 97.3,65.6 96.99,65.92 90.95,65.92 90.16,66.71 90.16,68.46 90.48,68.77 90.48,69.73 90,70.2 90,74.01 v89.53,74.49
M1QB-4  (via drill 0.6)
  Top 0.406: v125.4,74.49 MOTOR4.32
  Bottom 0.406: JP3.1 125.4,44.64 123.5,46.55 123.5,72.58 v125.4,74.49
MISO  (via drill 0.6)
  Top 0.305: MOTOR1.27 34.44,69.41 35.31,70.28 v37.77,70.28 | v57.46,70.6 57.46,69.49 MOTOR2.27 57.54,68.46 57.86,68.14 v68.25,68.14 | v77.78,65.6 89.21,65.6 90.88,67.27 90.88,67.9 91.11,68.14 92.78,68.14 93.42,68.77 93.41,68.78 MOTOR3.27
  Top 0.406: COM_BOARD.32 62.93,9.96 62.54,10.35 v62.54,20.51 | v62.54,26.23 68.25,31.94 v68.25,65.6 | MOTOR4.27 126.67,69.41 125.4,70.68 117.15,70.68 115.88,69.41 MOTOR3.27
  Bottom 0.305: v37.77,70.28 57.22,70.28 v57.46,70.6 | v68.25,65.6 v68.25,68.14 77.78,68.14 78.41,67.5 78.41,66.23 v77.78,65.6
  Bottom 0.406: v62.54,20.51 v62.54,26.23
MOSI  (via drill 0.58, 0.6)
  Top 0.305: v75.95,61.99 77.02,63.06 89.21,63.06 89.84,63.69 89.84,64.96 90.48,65.6 93.02,65.6 93.34,65.92 93.42,65.92 93.41,65.92 MOTOR3.25
  Top 0.406: COM_BOARD.30 65.47,9.96 65.08,10.35 v65.08,20.51 | v65.08,26.23 70.21,31.36 v70.21,62.96 70.21,65.4 68.74,66.87 MOTOR2.25 v53.89,66.87 | MOTOR1.25 v35.44,66.87 | MOTOR4.25 v126.04,66.87 | v124.77,68.14 93.89,68.14 93.49,67.74 93.49,66.95 MOTOR3.25
  Bottom 0.406: v65.08,20.51 v65.08,26.23 | v75.95,61.99 71.76,61.99 70.79,62.96 v70.21,62.96 | v35.44,66.87 37.34,64.96 48.25,64.96 49.12,64.09 51.11,64.09 v53.89,66.87 | v126.04,66.87 v124.77,68.14
N$1  (via drill 0.6)
  Top 0.305: R31.2 RVOUT.2 70.79,100.52 SWITCH_Q.DRAIN
  Top 0.61: DRAIN_TEST.P$1 68.25,100.52 70.79,100.52 | U$3.P$7 41.35,98.14 41.13,97.93 41.17,98.01 v39.04,97.98
  Top 1.676: U$3.P$6 U$3.P$7
  Bottom 0.61: v39.04,97.98 DRAIN_TEST.P$1
N$2
  Top 0.406: R1.1 118.47,110.36 U$4.5
N$3  (via drill 0.6)
  Top 0.406: v122.23,97.98 R2.2
  Bottom 0.406: KICK_Q1.GATE 126.24,97.98
  Bottom 1.93: 126.24,97.98 v122.23,97.98
N$4
  Top 1.676: MOTOR3.1 105.48,36.39 113.34,28.29
  Top 1.778: MOTOR3.1 MOTOR3.3 MOTOR3.5 MOTOR3.6 MOTOR3.4 MOTOR3.2 | FUSE_MOTOR_6.2 113.34,28.29
N$5
  Top 0.406: R2.1 117.84,98.3 U$1.5
N$6
  Top 0.305: CHARGE_U.P$8 58.98,98.73 R31.1
N$7
  Top 0.305: CHARGE_U.P$10 56.4,99.73 C19.1 RBG.2
N$8  (via drill 0.6)
  Top 0.406: v122.23,111.32 R1.2
  Bottom 0.406: v122.23,111.32 123.53,111.99 KICK_Q.GATE
N$9
  Top 0.305: SWITCH_Q.GATE 68.53,94.17 GATE_TEST.P$1 60.95,94.17 56.89,98.23 CHARGE_U.P$7
N$10
  Bottom 0.406: R3.1 36.82,124.65 39.68,122.11 40.31,122.11 | 40.31,122.11 41.2,122.11 U$2.LOWER_RIGHT | U$6.RIGHT 30.15,123.38 32.69,120.84 35.87,120.84 37.77,118.94 39.04,118.94 40.31,120.21 40.31,122.11
N$11
  Top 0.254: R4.1 KE_LED.C
N$12
  Top 0.305: CHARGE_U.P$9 57.81,99.23 RVOUT.1
N$13
  Top 0.254: R5.1 CE_LED.C
N$14
  Top 0.305: COMP_LED.C 89.21,101.56 R6.2
N$15
  Top 0.61: KICK_LED.C R9.2
N$16  (via drill 3.17)
  other vias: 18.9,16.25
N$17
  Top 0.61: R10.2 CHIP_LED.C
N$18  (via drill 0.6)
  Top 0.305: v31.42,125.29 28.25,125.29 27.61,125.92 27.61,127.83 28.88,129.1 U$6.CENTER
  Bottom 0.305: R3.2 32.06,124.65 v31.42,125.29
  Bottom 0.406: R16.2 R13.1 34.23,130.74 33.96,131 32.06,131 31.42,130.37 30.79,130.37 30.15,129.73 U$6.CENTER
N$19  (via drill 0.6)
  Top 0.305: v48.57,94.17 DONE_LED.C
  Bottom 0.305: R12.1 DONE_LED.C v48.57,94.17
N$20  (via drill 0.6)
  Top 0.305: CHARGE_LED.C v51.11,94.17
  Bottom 0.305: v51.11,94.17 R11.1
N$21  (via drill 0.6)
  Top 0.61: v37.77,121.48 v44.76,121.48
  Bottom 0.406: 46.41,121.48 U$2.LOWER_LEFT
  Bottom 0.61: R25.1 32.43,122.38 32.88,121.92 37.33,121.92 v37.77,121.48 | v44.76,121.48 46.41,121.48
N$23  (via drill 0.6)
  Top 0.406: v36.5,82.74 33.96,82.74 31.83,84.88 PW_LED1.C
  Bottom 0.406: R21.2 34.97,81.21 v36.5,82.74
N$24
  Top 0.305: CHARGE_U.P$6 56.44,97.73 63.17,91 72.06,91 73.97,92.9 73.97,94.53 SWITCH_Q.SOURCE
  Top 0.61: RSENSE.2 74.66,95.7 SWITCH_Q.SOURCE
N$25
  Top 1.676: FUSE_MOTOR_7.2 122.86,35.68 MOTOR4.2
  Top 1.778: MOTOR4.2 MOTOR4.4 MOTOR4.6 MOTOR4.5 MOTOR4.3 MOTOR4.1
N$26
  Top 1.676: FUSE_MOTOR_5.2 50.4,30.6 50.4,37.02
  Top 1.778: MOTOR2.2 50.4,37.02 MOTOR2.4 MOTOR2.6 MOTOR2.5 MOTOR2.3 MOTOR2.1
N$27
  Top 1.676: MOTOR1.1 29.52,28.53 FUSE_MOTOR_3.2
  Top 1.778: MOTOR1.1 MOTOR1.3 MOTOR1.5 MOTOR1.6 MOTOR1.4 MOTOR1.2
N$28
  Top 1.676: COMS_BOARD_FUSE.2 111.67,17.1 COM_BOARD.1 COM_BOARD.3 COM_BOARD.5
N$29  (via drill 0.6)
  Top 0.61: v35.87,126.56 33.96,126.56 v32.38,127.51
  Bottom 0.406: 31.69,112.96 R23.2 | v32.38,127.51 32.38,126.93 R16.1
  Bottom 0.61: R23.2 37.14,113.22 43.49,119.57 43.49,126.56 v35.87,126.56 | U$5.4 31.69,112.96
N$30
  Bottom 0.406: U$5.1 29.34,102.24 R26.2
N$31  (via drill 3.17)
  other vias: 124.97,16.25
N$32
  Bottom 0.305: R19.2 39.04,4.73 BB_CON.4
N$33  (via drill 3.17)
  other vias: 129.39,117.49
N$34  (via drill 3.17)  (1 unrouted)
  other vias: 71.94,144.28 14.48,117.49
N$36
  Bottom 1.676: U$7.- 38.65,134.69 41.22,132.11
  Bottom 1.778: 42.35,134.05 41.22,132.11 U$2.TAB
N$37  (via drill 0.8)
  Top 1.676: MOTOR2.8 MOTOR2.10 v54.28,46.55 MOTOR2.9 MOTOR2.7
  Bottom 0.406: U$8.10 5.48,68.68 5.39,68.77
  Bottom 0.813: U$8.10 U$8.11
  Bottom 1.676: 5.39,68.77 7.69,68.77 10.71,71.79 27.45,71.79 34.6,64.73 34.6,57.03 46.19,45.44 53.17,45.44 v54.28,46.55
N$38  (via drill 0.8)
  Top 1.676: MOTOR2.12 MOTOR2.14 v53.97,51.63 MOTOR2.13 MOTOR2.11
  Bottom 0.305: U$8.8 5.48,66.81 5.55,66.87
  Bottom 0.813: U$8.8 U$8.9
  Bottom 1.676: 5.55,66.87 9.12,66.87 11.82,69.57 26.98,69.57 32.53,64.01 32.53,55.6 44.76,43.37 53.97,43.37 56.82,46.23 56.82,48.77 v53.97,51.63
N$39  (via drill 0.8)
  Top 1.676: MOTOR2.16 MOTOR2.18 v53.97,56.71 MOTOR2.17 MOTOR2.15
  Bottom 0.305: U$8.6 5.48,64.74 5.55,64.81
  Bottom 0.813: U$8.6 U$8.7
  Bottom 1.676: 5.55,64.81 9.99,64.81 12.77,67.58 26.18,67.58 30.47,63.3 30.47,54.33 43.96,40.83 54.92,40.83 59.36,45.28 59.36,51.31 v53.97,56.71
N$40
  Bottom 0.305: BB_CON.1 44.95,5.08 43.49,6.54 R20.2
N$42  (via drill 0.6)
  Top 0.305: v53.97,59.25 MOTOR2.20
  Bottom 0.305: U$8.4 9.29,62.33 9.83,61.79 10.47,61.79 11.1,62.42 11.1,64.09 13.41,66.39 25.55,66.39 28.96,62.98 28.96,53.77 43.49,39.25 55.39,39.25 60.79,44.64 60.79,52.42 v53.97,59.25
N$43  (via drill 0.6)
  Top 0.305: v53.97,60.68 56.82,60.68 57.46,60.04 57.46,59.33 MOTOR2.19
  Bottom 0.305: U$8.3 9.34,61.33 9.67,61 10.79,61 11.74,61.95 11.74,63.85 13.8,65.92 25.15,65.92 28.41,62.74 28.41,53.53 43.33,38.61 55.55,38.61 61.43,44.49 61.43,53.22 v53.97,60.68
N$44  (via drill 0.6)
  Top 0.305: v53.97,62.11 54.36,61.79 MOTOR2.21
  Bottom 0.305: U$8.2 11.07,60.33 12.37,61.63 12.37,63.62 14.12,65.36 24.76,65.36 27.77,62.35 27.77,53.38 43.01,38.14 55.87,38.14 62.06,44.33 62.06,54.01 v53.97,62.11
N$45  (via drill 0.6)
  Top 0.305: v53.97,63.54 53.97,63.85 54.44,64.33 MOTOR2.23
  Bottom 0.305: U$8.1 11.18,59.33 13.01,61.15 13.01,63.22 14.6,64.81 24.44,64.81 27.14,62.11 27.14,53.06 42.69,37.5 56.03,37.5 62.7,44.17 62.7,54.8 v53.97,63.54
N$46  (via drill 0.6)
  Top 1.676: 17.9,46.55 MOTOR1.9 MOTOR1.7 | v17.9,48.52 17.9,46.55 | 17.9,46.55 MOTOR1.10 MOTOR1.8
  Bottom 0.406: 5.29,48.3 5.39,48.52
  Bottom 0.813: U$11.10 5.29,48.3 U$11.11
  Bottom 1.676: 5.39,48.52 v17.9,48.52
N$47  (via drill 0.6)
  Top 1.676: MOTOR1.11 MOTOR1.13 v18.09,51.63 MOTOR1.14 MOTOR1.12
  Bottom 0.305: 5.39,46.49 5.26,46.41 U$11.9
  Bottom 0.813: U$11.9 U$11.8
  Bottom 1.676: v18.09,51.63 21.26,48.39 21.26,46.49 5.39,46.49
N$48  (via drill 0.6)
  Top 1.676: MOTOR1.16 MOTOR1.18 v18.09,56.71 MOTOR1.17 MOTOR1.15
  Bottom 0.305: U$11.7 5.29,44.52 U$11.6
  Bottom 1.676: 5.29,44.52 22.37,44.52 24.06,46.3 24.06,48.84 18.09,54.8 v18.09,56.71
N$49  (via drill 3.17)  (1 unrouted)
  other vias: 137.94,69.28 8.4,80.08
N$50  (via drill 0.6)
  Top 0.406: v18.09,59.25 MOTOR1.20
  Bottom 0.406: U$11.4 22.44,42.01 25.71,45.28 25.71,49.09 19.99,54.8 19.99,57.34 v18.09,59.25
N$51  (via drill 0.6)
  Top 0.406: v18.09,60.84 20.95,60.84 21.58,60.2 21.58,59.33 MOTOR1.19
  Bottom 0.406: U$11.3 22.71,41.01 26.66,44.96 26.66,49.41 20.95,55.12 20.95,57.98 v18.09,60.84
N$52  (via drill 0.6)
  Top 0.406: v18.09,62.42 18.72,61.79 MOTOR1.21
  Bottom 0.406: U$11.2 22.91,40.01 27.61,44.64 27.61,49.72 21.9,55.44 21.9,58.61 v18.09,62.42
N$53  (via drill 0.6)
  Top 0.406: v18.09,64.01 18.25,64.17 21.5,64.17 MOTOR1.23
  Bottom 0.406: U$11.1 23.12,39.01 28.57,44.33 28.57,50.04 22.85,55.76 22.85,59.25 v18.09,64.01
N$54  (via drill 0.6)
  Top 1.676: MOTOR3.7 MOTOR3.9 v89.84,46.55 MOTOR3.10 MOTOR3.8
  Bottom 0.305: U$9.11 138.64,76.93 138.74,77.03
  Bottom 0.813: U$9.11 U$9.10
  Bottom 1.676: 138.74,77.03 122.86,77.03 92.38,46.55 v89.84,46.55
N$55  (via drill 0.6)
  Top 1.676: MOTOR3.12 MOTOR3.14 89.21,51.63 v89.84,51.63 MOTOR3.13 MOTOR3.11
  Bottom 0.305: U$9.9 138.64,78.84 138.74,78.93
  Bottom 0.813: U$9.8 U$9.9
  Bottom 1.676: 138.74,78.93 121.59,78.93 94.29,51.63 v89.84,51.63
N$56  (via drill 0.6)
  Top 1.676: MOTOR3.16 MOTOR3.18 v89.84,56.71 MOTOR3.17 MOTOR3.15
  Bottom 0.305: U$9.7 138.64,80.93 138.58,81
  Bottom 0.813: U$9.6 U$9.7
  Bottom 1.676: v89.84,56.71 96.19,56.71 120.48,81 138.58,81
N$58  (via drill 0.6)
  Top 0.305: v89.68,59.09 86.43,59.09 MOTOR3.20
  Bottom 0.305: U$9.4 135.94,83.47 134.9,82.43 119.85,82.43 95.88,58.46 90.32,58.46 v89.68,59.09
N$59  (via drill 0.6)
  Top 0.305: v90,60.52 92.7,60.52 93.34,59.88 93.34,59.33 MOTOR3.19
  Bottom 0.305: U$9.3 136.12,84.47 134.55,82.9 119.53,82.9 95.88,59.25 91.27,59.25 v90,60.52
N$60  (via drill 0.6)
  Top 0.305: v96.35,61.79 MOTOR3.21
  Bottom 0.305: U$9.2 136.29,85.47 134.2,83.38 119.21,83.38 97.62,61.79 v96.35,61.79
N$61  (via drill 0.6)
  Top 0.305: v96.35,64.33 MOTOR3.23
  Bottom 0.305: U$9.1 136.47,86.47 133.85,83.86 118.89,83.86 99.37,64.33 v96.35,64.33
N$62  (via drill 0.6)
  Top 1.422: MOTOR4.8 MOTOR4.10 v125.4,46.55 MOTOR4.9 MOTOR4.7
  Bottom 0.305: U$10.11 138.01,51.53 138.1,51.63
  Bottom 0.813: U$10.11 U$10.10
  Bottom 1.422: 138.1,51.63 130.48,51.63 v125.4,46.55
N$63  (via drill 0.6)
  Top 1.676: MOTOR4.11 MOTOR4.13 v125.4,51.63 MOTOR4.14 MOTOR4.12
  Bottom 0.406: U$10.9 138.01,53.44 138.1,53.53
  Bottom 0.813: U$10.9 U$10.8
  Bottom 1.676: 138.1,53.53 127.31,53.53 v125.4,51.63
N$64  (via drill 0.6)
  Top 1.676: MOTOR4.15 MOTOR4.17 v125.72,56.71 MOTOR4.18 MOTOR4.16
  Bottom 0.305: U$10.6 138.01,55.66 137.94,55.6
  Bottom 0.813: U$10.7 U$10.6
  Bottom 1.676: 137.94,55.6 126.83,55.6 v125.72,56.71
N$66  (via drill 0.6)
  Top 0.406: v126.2,59.41 122.31,59.41 MOTOR4.20
  Bottom 0.406: U$10.4 127.53,58.07 v126.2,59.41
N$67  (via drill 0.6)
  Top 0.406: v129.21,60.52 129.21,59.33 MOTOR4.19
  Bottom 0.406: U$10.3 130.66,59.07 v129.21,60.52
N$68  (via drill 0.6)
  Top 0.406: v126.67,61.87 129.21,61.87 MOTOR4.21
  Bottom 0.406: U$10.2 131,60.07 129.13,61.87 126.75,61.87 v126.67,61.87
N$69  (via drill 0.6)
  Top 0.406: v129.21,65.6 129.21,64.41 MOTOR4.23
  Bottom 0.406: U$10.1 131.2,61.07 130.48,61.79 130.48,64.33 v129.21,65.6
SCK  (via drill 0.6)
  Top 0.305: MOTOR1.29 v43.49,71.95 | v54.36,71.95 MOTOR2.29 67.62,71.95 v72.7,66.87 | MOTOR3.29 91.11,71.95 90.48,71.31 90.48,68.77 89.84,68.14 77.78,68.14 v76.51,66.87
  Top 0.406: COM_BOARD.28 68.01,9.96 67.62,10.35 v67.62,20.51 | v67.62,26.23 72.7,31.31 v72.7,66.87 | MOTOR4.29 126.67,71.95 125.4,73.22 119.05,73.22 117.78,71.95 MOTOR3.29
  Bottom 0.305: v43.49,71.95 43.65,71.95 44.52,71.08 53.49,71.08 v54.36,71.95
  Bottom 0.406: v67.62,20.51 v67.62,26.23 | v76.51,66.87 v72.7,66.87
SS1  (via drill 0.6)
  Top 0.305: MOTOR1.31 21.66,73.7 v21.9,73.46 | v40.15,54.33 40.15,35.83 45.63,30.36 v45.63,29.17 | v48.81,25.99 57.78,26.07 v60.08,28.37 | v79.13,7.1 79.13,9.88 COM_BOARD.20
  Bottom 0.305: v21.9,73.46 22.37,72.98 28.01,72.98 35.79,65.2 35.79,57.5 40.15,53.14 v40.15,54.33 | v45.63,29.17 v48.81,25.99 | v60.08,28.37 60.08,28.21 61.35,26.94 61.35,7.58 62.38,6.54 78.57,6.54 v79.13,7.1
SS2  (via drill 0.6)
  Top 0.305: 40.31,68.14 53.65,68.14 54.28,68.77 54.28,70.68 53.49,71.47 53.49,73.93 54.05,74.49 MOTOR2.31
  Top 0.406: 40.31,68.14 39.04,66.87 39.04,35.75 44.12,30.67 44.12,28.77 43.49,28.13 39.68,28.13 38.41,26.86 38.41,23.69 v35.23,20.51 | v35.23,11.62 35.23,10.35 36.5,9.08 44.12,9.08 49.84,3.37 75.24,3.37 76.51,4.64 COM_BOARD.22
  Bottom 0.406: v35.23,20.51 v35.23,11.62
SS3  (via drill 0.6)
  Top 0.305: MOTOR3.31 91.11,74.49 90.32,73.78 90.32,71.92 89.08,70.68 79.06,70.68 78.82,70.45 74.6,66.23
  Top 0.406: 74.6,66.23 74.6,30.67 v70.16,26.23 | v70.16,20.51 70.16,14.16 70.79,13.53 73.33,13.53 73.97,12.89 COM_BOARD.24
  Bottom 0.406: v70.16,26.23 v70.16,20.51
SS4  (via drill 0.6)
  Top 0.305: MOTOR4.31 131.75,74.49 132.39,73.85 v132.39,70.68 | v132.39,66.87 132.39,63.69 131.75,63.06 118.42,63.06 117.78,62.42 117.78,26.23 116.51,24.96 110.16,24.96 109.53,25.59 73.33,25.59 v72.7,26.23
  Top 0.406: COM_BOARD.26 v71.43,7.34
  Bottom 0.305: v132.39,70.68 v132.39,66.87
  Bottom 0.406: v71.43,7.34 71.43,14.16 72.7,15.43 v72.7,26.23
TO_DRIB
  Bottom 0.61: DRIB.2 27.25,12.62 26.34,13.53 DRIB_TRAN.DRAIN
TO_NEON
  Bottom 0.61: R24.1 115.88,115.76 NEON.1
TRANS_OUT
  Top 1.676: CHARGE_D.A 20.63,113.22 19.99,113.22 18.72,111.95 U$3.P$1
UNBUF_DIVCAP
  Bottom 0.305: 83.29,108.29 CAP_SENSE_BUF.3 | 82.17,109.41 CLAMP2.C
  Bottom 0.61: R14.1 R15.2 89.33,108.41 CLAMP1.A 83.29,108.29 82.17,109.41

## Text on the board
Dimension: MOTOR BOARD DIMENSION
bPlace: C:/Users/JohnAlex/Downloads/1053199_481094518647458_1043735417_o.bmp